# Altium project PCB_Project.PrjPcb (part 5 of 10)

## Sheet УШЯИ.411618.029Э Э3 Лист 4.schdoc
size 420 x 297 mm; SheetNumber: 4; SheetTotal: 8
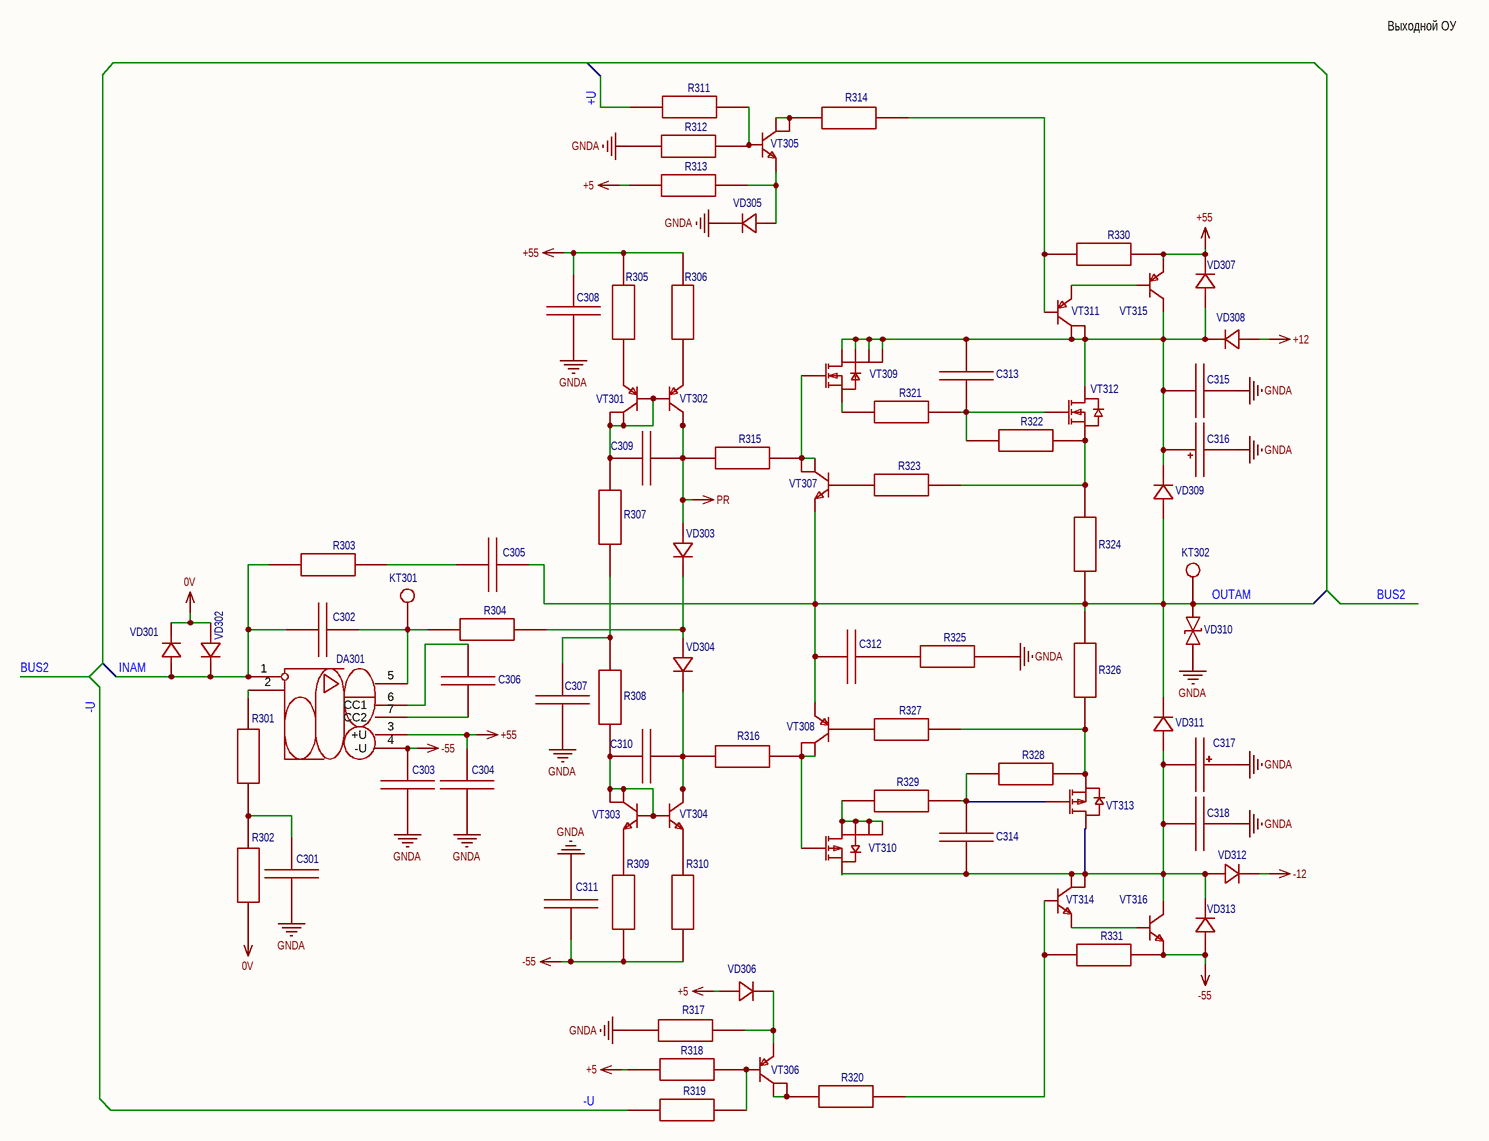
[diagram p3: УШЯИ.411618.029Э Э3 Лист 4.schdoc]

### Parts
C301  Конденсатор SMD 1мкФ 100В X7R 10% [0805]  [C0805]  (value not drawn)
C302  Конденсатор SMD 33пФ 100В X7R 10% [0805]  [C0805]  (value not drawn)
C303  Конденсатор SMD 68нФ 100В X7R 10% [0805]  [C0805]  (value not drawn)
C304  Конденсатор SMD 68нФ 100В X7R 10% [0805]  [C0805]  (value not drawn)
C305  Конденсатор SMD 10пФ 100В X7R 10% [0805]  [C0805]  (value not drawn)
C306  Конденсатор SMD 10пФ 100В X7R 10% [0805]  [C0805]  (value not drawn)
C307  Конденсатор SMD 68нФ 250В X7R 10% [0805]  [C0805]  (value not drawn)
C308  Конденсатор SMD 68нФ 250В X7R 10% [0805]  [C0805]  (value not drawn)
C309  Конденсатор SMD 10пФ 100В X7R 10% [0805]  [C0805]  (value not drawn)
C310  Конденсатор SMD 10пФ 100В X7R 10% [0805]  [C0805]  (value not drawn)
C311  Конденсатор SMD 68нФ 250В X7R 10% [0805]  [C0805]  (value not drawn)
C312  Конденсатор SMD 10пФ 100В X7R 10% [0805]  [C0805]  (value not drawn)
C313  Конденсатор SMD 10пФ 100В X7R 10% [0805]  [C0805]  (value not drawn)
C314  Конденсатор SMD 10пФ 100В X7R 10% [0805]  [C0805]  (value not drawn)
C315  Конденсатор SMD 10пФ 100В X7R 10% [0805]  [C0805]  (value not drawn)
C316  ECAP (К50-35), 220мкФ, 100В, 105°C, 13x25, p:5мм  [CAP-TH_BD13.0-P5.00-D0.6-FD]  (value not drawn)
C317  ECAP (К50-35), 220мкФ, 100В, 105°C, 13x25, p:5мм  [CAP-TH_BD13.0-P5.00-D0.6-FD]  (value not drawn)
C318  Конденсатор SMD 10пФ 100В X7R 10% [0805]  [C0805]  (value not drawn)
DA301  Операционный усилитель PA340CC [TH]  (value not drawn)
KT301  Control point  (value not drawn)
KT302  Control point  (value not drawn)
R301  Резистор 4.6кОм 0,125Вт 1% [0805]  [R0805]  (value not drawn)
R302  Резистор 1.2кОм 0,125Вт 1% [0805]  [R0805]  (value not drawn)
R303  Резистор 1.8кОм 0,125Вт 1% [0805]  [R0805]  (value not drawn)
R304  Резистор 1.2кОм 0,125Вт 1% [0805]  [R0805]  (value not drawn)
R305  Резистор 220Ом 0,125Вт 1% [0805]  [R0805]  (value not drawn)
R306  Резистор 220Ом 0,125Вт 1% [0805]  [R0805]  (value not drawn)
R307  Резистор 22кОм 0,125Вт 1% [0805]  [R0805]  (value not drawn)
R308  Резистор 22кОм 0,125Вт 1% [0805]  [R0805]  (value not drawn)
R309  Резистор 220Ом 0,125Вт 1% [0805]  [R0805]  (value not drawn)
R310  Резистор 220Ом 0,125Вт 1% [0805]  [R0805]  (value not drawn)
R311  Резистор 3кОм 0,125Вт 1% [0805]  [R0805]  (value not drawn)
R312  Резистор 2.4кОм 0,125Вт 1% [0805]  [R0805]  (value not drawn)
R313  Резистор 7.2кОм 0,125Вт 1% [0805]  [R0805]  (value not drawn)
R314  Резистор 18кОм 0,125Вт 1% [0805]  [R0805]  (value not drawn)
R315  Резистор 120Ом 0,125Вт 1% [0805]  [R0805]  (value not drawn)
R316  Резистор 120Ом 0,125Вт 1% [0805]  [R0805]  (value not drawn)
R317  Резистор 7.2кОм 0,125Вт 1% [0805]  [R0805]  (value not drawn)
R318  Резистор 2.4кОм 0,125Вт 1% [0805]  [R0805]  (value not drawn)
R319  Резистор 3кОм 0,125Вт 1% [0805]  [R0805]  (value not drawn)
R320  Резистор 18кОм 0,125Вт 1% [0805]  [R0805]  (value not drawn)
R321  Резистор 240Ом 0.25Вт 1% [1206]  [R0805]  (value not drawn)
R322  Резистор 1кОм 0,125Вт 5% [0805]  [R0805]  (value not drawn)
R323  Резистор 300Ом 0,125Вт 1% [0805]  [R0805]  (value not drawn)
R324  Резистор MP930-0.04-1% [TO-220-2]  [TO-220-2_L10.4-W3.2-P5.08-L]  (value not drawn)
R325  Резистор 100Ом 0,125Вт 1% [0805]  [R0805]  (value not drawn)
R326  Резистор MP930-0.04-1% [TO-220-2]  [TO-220-2_L10.4-W3.2-P5.08-L]  (value not drawn)
R327  Резистор 300Ом 0,125Вт 1% [0805]  [R0805]  (value not drawn)
R328  Резистор 1кОм 0,125Вт 5% [0805]  [R0805]  (value not drawn)
R329  Резистор 240Ом 0.25Вт 1% [1206]  [R0805]  (value not drawn)
R330  Резистор 1.5кОм 0,125Вт 1% [0805]  [R0805]  (value not drawn)
R331  Резистор 1.5кОм 0,125Вт 1% [0805]  [R0805]  (value not drawn)
VD301  Диод импульсный 1N4448 [SOD-123]  [SOD-123_L2.7-W1.6-LS3.7-RD-1]  (value not drawn)
VD302  Диод импульсный 1N4448 [SOD-123]  [SOD-123_L2.7-W1.6-LS3.7-RD-1]  (value not drawn)
VD303  Диод импульсный 1N4448 [SOD-123]  [SOD-123_L2.7-W1.6-LS3.7-RD-1]  (value not drawn)
VD304  Диод импульсный 1N4448 [SOD-123]  [SOD-123_L2.7-W1.6-LS3.7-RD-1]  (value not drawn)
VD305  Диод импульсный 1N4448 [SOD-123]  [SOD-123_L2.7-W1.6-LS3.7-RD-1]  (value not drawn)
VD306  Диод импульсный 1N4448 [SOD-123]  [SOD-123_L2.7-W1.6-LS3.7-RD-1]  (value not drawn)
VD307  Диод RS1M [SMA] (допускается замена на FR307 [DO-201AD])  (value not drawn)
VD308  Диод КД2970А [TO-220AC]  [TO-220AC-2_L10.0-W4.5-P5.08-T]  (value not drawn)
VD309  Диод RS1M [SMA] (допускается замена на FR307 [DO-201AD])  (value not drawn)
VD310  Диод защитный 1.5KE56CA [DO-201AD/DO-27]  [DO-201]  (value not drawn)
VD311  Диод RS1M [SMA] (допускается замена на FR307 [DO-201AD])  (value not drawn)
VD312  Диод КД2970А [TO-220AC]  [TO-220AC-2_L10.0-W4.5-P5.08-T]  (value not drawn)
VD313  Диод RS1M [SMA] (допускается замена на FR307 [DO-201AD])  (value not drawn)
VT301  Транзистор DZTA92 PNP [SOT223]  [SOT-223-3_L6.5-W3.4-P2.30-LS7.0-BR]  (value not drawn)
VT302  Транзистор FZT758 PNP [SOT223]  [SOT-223_L6.5-W3.5-P2.30-LS7.0-BR]  (value not drawn)
VT303  Транзистор DZTA42 NPN [SOT223]  [SOT-223-4_L6.5-W3.5-P2.30-LS7.0-BR]  (value not drawn)
VT304  Транзистор FZT658 NPN [SOT223]  [SOT-223_L6.5-W3.5-P2.30-LS7.0-BR]  (value not drawn)
VT305  Транзистор DZTA42 NPN [SOT223]  [SOT-223-4_L6.5-W3.5-P2.30-LS7.0-BR]  (value not drawn)
VT306  Транзистор DZTA92 PNP [SOT223]  [SOT-223-3_L6.5-W3.4-P2.30-LS7.0-BR]  (value not drawn)
VT307  Транзистор DZTA42 NPN [SOT223]  [SOT-223-4_L6.5-W3.5-P2.30-LS7.0-BR]  (value not drawn)
VT308  Транзистор DZTA92 PNP [SOT223]  [SOT-223-3_L6.5-W3.4-P2.30-LS7.0-BR]  (value not drawn)
VT309  Транзистор ZXMN10A08E6 N-канал 100В 1.9А [SOT-23-6]  [SOT-23-6_L2.9-W1.6-P0.95-LS2.7-BL]  (value not drawn)
VT310  Транзистор ZXMP10A17E6 P-канал 100В 1.3А [SOT-23-6]  [SOT-23-6_L2.9-W1.6-P0.95-LS2.8-BL]  (value not drawn)
VT311  Транзистор DZTA92 PNP [SOT223]  [SOT-223-3_L6.5-W3.4-P2.30-LS7.0-BR]  (value not drawn)
VT312  Транзистор FQP13N10  N-канал 100В 12.8А [TO-220]  (value not drawn)
VT313  Транзистор SFP9530 P-канал 100В 10.5А [TO-220]  (value not drawn)
VT314  Транзистор DZTA42 NPN [SOT223]  [SOT-223-4_L6.5-W3.5-P2.30-LS7.0-BR]  (value not drawn)
VT315  Транзистор MJE5730G PNP [TO-220-3]  [TO-220-3_L10.0-W4.5-P2.54-L]  (value not drawn)
VT316  Транзистор TIP48 NPN [TO-220-3]  [TO-220-3_L10.0-W4.5-P2.54-L]  (value not drawn)

### Nets
0V: R302.1 VD301.1(C) VD302.2(A)
+5: R313.1 R318.1 VD306.2(A)
+12: VD308.3(A)
+55: C304.2 C308.1 DA301.3(+U) R305.1 R306.1 R330.2 VD307.1(K) VT315.3(E)
-12: VD312.1(K)
-55: C303.2 C311.2 DA301.4(-U) R309.1 R310.1 R331.2 VD313.2(A) VT316.3(E)
GNDA: C301.1 C303.1 C304.1 C307.1 C308.2 C311.1 C315.2 C316.2 C317.1 C318.2 R312.1 R317.1 R325.2 VD305.1(C) VD310.1
PR: C309.1 R315.1 VD303.2(A) VT302.2(C) VT302.4(C)
+U: R311.1
-U: R319.1
INAM: C302.2 DA301.1(-) R303.2 VD301.2(A) VD302.1(C)
OUTAM: C305.1 C312.1 KT302.1 R324.1 R326.2 VD309.2(A) VD310.2 VD311.1(K) VT307.3(E) VT308.3(E)
NetC301_2: C301.2 R301.1 R302.2
NetC302_1: C302.1 DA301.5(Out) KT301.1 R304.2
NetC305_2: C305.2 R303.1
NetC306_1: C306.1 DA301.6(CC1)
NetC306_2: C306.2 DA301.7(CC2)
NetC307_2: C307.2 R307.2 R308.2
NetC309_2: C309.2 R307.1 VT301.1(B) VT301.2(C) VT301.4(C) VT302.1(B)
NetC310_1: C310.1 R316.1 VD304.1(C) VT304.2(C) VT304.4(C)
NetC310_2: C310.2 R308.1 VT303.1(B) VT303.2(C) VT303.4(C) VT304.1(B)
NetC312_2: C312.2 R325.1
NetC313_1: C313.1 C315.1 C316.1 VD307.2(A) VD308.1(K) VD309.1(K) VT309.1(D) VT309.2(D) VT309.5(D) VT309.6(D) VT311.2(C) VT311.4(C) VT312.2(D) VT315.2(C)
NetC313_2: C313.2 R321.2 R322.2 VT312.1(G)
NetC314_1: C314.1 R328.1 R329.2 VT313.1(G)
NetC314_2: C314.2 C317.2 C318.1 VD311.2(A) VD312.3(A) VD313.1(K) VT310.4(S) VT313.2(D) VT314.2(C) VT314.4(C) VT316.2(C)
NetDA301_2: DA301.2(+) R301.2
NetR304_1: R304.1 VD303.1(C) VD304.2(A)
NetR305_2: R305.2 VT301.3(E)
NetR306_2: R306.2 VT302.3(E)
NetR309_2: R309.2 VT303.3(E)
NetR310_2: R310.2 VT304.3(E)
NetR311_2: R311.2 R312.2 VT305.1(B)
NetR313_2: R313.2 VD305.2(A) VT305.3(E)
NetR314_1: R314.1 VT305.2(C) VT305.4(C)
NetR314_2: R314.2 R330.1 VT311.1(B)
NetR315_2: R315.2 VT307.2(C) VT307.4(C) VT309.3(G)
NetR316_2: R316.2 VT308.2(C) VT308.4(C) VT310.3(G)
NetR317_2: R317.2 VD306.1(C) VT306.3(E)
NetR318_2: R318.2 R319.2 VT306.1(B)
NetR320_1: R320.1 VT306.2(C) VT306.4(C)
NetR320_2: R320.2 R331.1 VT314.1(B)
NetR321_1: R321.1 VT309.4(S)
NetR322_1: R322.1 R323.2 R324.2 VT312.3(S)
NetR323_1: R323.1 VT307.1(B)
NetR326_1: R326.1 R327.2 R328.2 VT313.3(S)
NetR327_1: R327.1 VT308.1(B)
NetR329_1: R329.1 VT310.1(D) VT310.2(D) VT310.5(D) VT310.6(D)
NetVT311_3: VT311.3(E) VT315.1(B)
NetVT314_3: VT314.3(E) VT316.1(B)

### Buses and harness runs
bus BUS2

### Notes on the sheet
- Выходной ОУ
- Подп. и дата
- Инв.№ дубл.
- Взам.инв.№
- Подп.и дата
- Инв.№ подл.
- Изм.
- Лист
- № докум.
- Подп.
- Дата
- Формат  A3

### Library data of the parts
C301 = Конденсатор SMD 1мкФ 100В X7R 10% [0805]: Contributor: jordanjin; Convert to PCB: yes; UniqueId: gge0f82af17b1059d9e; Origin Footprint: C0805; Device: Конденсатор SMD 1мкФ 100В X7R 10% [0805]; Symbol: Конденсатор SMD 1мкФ 100В X7R 10% [0805]; Manufacturer Part: C0805; spicePre: C; spiceSymbolName: Конденсатор SMD 100нФ 100В X7R 10% [0805]; Add into BOM: yes; FootprintName: C0805
C302 = Конденсатор SMD 33пФ 100В X7R 10% [0805]: Contributor: jordanjin; Convert to PCB: yes; UniqueId: gge26cd05763e454dc0; Origin Footprint: C0805; Device: Конденсатор SMD 33пФ 100В X7R 10% [0805]; Symbol: Конденсатор SMD 33пФ 100В X7R 10% [0805]; Manufacturer Part: C0805; spicePre: C; spiceSymbolName: Конденсатор SMD 100нФ 100В X7R 10% [0805]; Add into BOM: yes; FootprintName: C0805
C303 = Конденсатор SMD 68нФ 100В X7R 10% [0805]: Contributor: jordanjin; Convert to PCB: yes; UniqueId: ggedf5c42e49c7cc26e; Origin Footprint: C0805; Device: Конденсатор SMD 68нФ 100В X7R 10% [0805]; Symbol: Конденсатор SMD 68нФ 100В X7R 10% [0805]; Manufacturer Part: C0805; spicePre: C; spiceSymbolName: Конденсатор SMD 100нФ 100В X7R 10% [0805]; Add into BOM: yes; FootprintName: C0805
C304 = Конденсатор SMD 68нФ 100В X7R 10% [0805]: Contributor: jordanjin; Convert to PCB: yes; UniqueId: gged5cf4cf4a29966fc; Origin Footprint: C0805; Device: Конденсатор SMD 68нФ 100В X7R 10% [0805]; Symbol: Конденсатор SMD 68нФ 100В X7R 10% [0805]; Manufacturer Part: C0805; spicePre: C; spiceSymbolName: Конденсатор SMD 100нФ 100В X7R 10% [0805]; Add into BOM: yes; FootprintName: C0805
C305 = Конденсатор SMD 10пФ 100В X7R 10% [0805]: Contributor: jordanjin; Convert to PCB: yes; UniqueId: ggedef2608488099cc0; Origin Footprint: C0805; Device: Конденсатор SMD 10пФ 100В X7R 10% [0805]; Symbol: Конденсатор SMD 10пФ 100В X7R 10% [0805]; Manufacturer Part: C0805; spicePre: C; spiceSymbolName: Конденсатор SMD 100нФ 100В X7R 10% [0805]; Add into BOM: yes; FootprintName: C0805
C306 = Конденсатор SMD 10пФ 100В X7R 10% [0805]: Contributor: jordanjin; Convert to PCB: yes; UniqueId: ggef91583ce116bdb52; Origin Footprint: C0805; Device: Конденсатор SMD 10пФ 100В X7R 10% [0805]; Symbol: Конденсатор SMD 10пФ 100В X7R 10% [0805]; Manufacturer Part: C0805; spicePre: C; spiceSymbolName: Конденсатор SMD 100нФ 100В X7R 10% [0805]; Add into BOM: yes; FootprintName: C0805
C307 = Конденсатор SMD 68нФ 250В X7R 10% [0805]: Contributor: jordanjin; Convert to PCB: yes; UniqueId: gge15aca19a3a582702; Origin Footprint: C0805; Device: Конденсатор SMD 68нФ 250В X7R 10% [0805]; Symbol: Конденсатор SMD 68нФ 250В X7R 10% [0805]; Manufacturer Part: C0805; spicePre: C; spiceSymbolName: Конденсатор SMD 100нФ 100В X7R 10% [0805]; Add into BOM: yes; FootprintName: C0805
C308 = Конденсатор SMD 68нФ 250В X7R 10% [0805]: Contributor: jordanjin; Convert to PCB: yes; UniqueId: gge93f8d871f7b0b0ae; Origin Footprint: C0805; Device: Конденсатор SMD 68нФ 250В X7R 10% [0805]; Symbol: Конденсатор SMD 68нФ 250В X7R 10% [0805]; Manufacturer Part: C0805; spicePre: C; spiceSymbolName: Конденсатор SMD 100нФ 100В X7R 10% [0805]; Add into BOM: yes; FootprintName: C0805
C309 = Конденсатор SMD 10пФ 100В X7R 10% [0805]: Contributor: jordanjin; Convert to PCB: yes; UniqueId: ggea76501cfc0b23d2d; Origin Footprint: C0805; Device: Конденсатор SMD 10пФ 100В X7R 10% [0805]; Symbol: Конденсатор SMD 10пФ 100В X7R 10% [0805]; Manufacturer Part: C0805; spicePre: C; spiceSymbolName: Конденсатор SMD 100нФ 100В X7R 10% [0805]; Add into BOM: yes; FootprintName: C0805
C310 = Конденсатор SMD 10пФ 100В X7R 10% [0805]: Contributor: jordanjin; Convert to PCB: yes; UniqueId: ggeadc4d9bfe63e7c4e; Origin Footprint: C0805; Device: Конденсатор SMD 10пФ 100В X7R 10% [0805]; Symbol: Конденсатор SMD 10пФ 100В X7R 10% [0805]; Manufacturer Part: C0805; spicePre: C; spiceSymbolName: Конденсатор SMD 100нФ 100В X7R 10% [0805]; Add into BOM: yes; FootprintName: C0805
C311 = Конденсатор SMD 68нФ 250В X7R 10% [0805]: Contributor: jordanjin; Convert to PCB: yes; UniqueId: ggefa3ff9baf1758d60; Origin Footprint: C0805; Device: Конденсатор SMD 68нФ 250В X7R 10% [0805]; Symbol: Конденсатор SMD 68нФ 250В X7R 10% [0805]; Manufacturer Part: C0805; spicePre: C; spiceSymbolName: Конденсатор SMD 100нФ 100В X7R 10% [0805]; Add into BOM: yes; FootprintName: C0805
C312 = Конденсатор SMD 10пФ 100В X7R 10% [0805]: Contributor: jordanjin; Convert to PCB: yes; UniqueId: ggea607186c08aa057a; Origin Footprint: C0805; Device: Конденсатор SMD 10пФ 100В X7R 10% [0805]; Symbol: Конденсатор SMD 10пФ 100В X7R 10% [0805]; Manufacturer Part: C0805; spicePre: C; spiceSymbolName: Конденсатор SMD 100нФ 100В X7R 10% [0805]; Add into BOM: yes; FootprintName: C0805
C313 = Конденсатор SMD 10пФ 100В X7R 10% [0805]: Contributor: jordanjin; Convert to PCB: yes; UniqueId: gge9e7b3f4a13bee05d; Origin Footprint: C0805; Device: Конденсатор SMD 10пФ 100В X7R 10% [0805]; Symbol: Конденсатор SMD 10пФ 100В X7R 10% [0805]; Manufacturer Part: C0805; spicePre: C; spiceSymbolName: Конденсатор SMD 100нФ 100В X7R 10% [0805]; Add into BOM: yes; FootprintName: C0805
C314 = Конденсатор SMD 10пФ 100В X7R 10% [0805]: Contributor: jordanjin; Convert to PCB: yes; UniqueId: ggec9cb2e765516c74f; Origin Footprint: C0805; Device: Конденсатор SMD 10пФ 100В X7R 10% [0805]; Symbol: Конденсатор SMD 10пФ 100В X7R 10% [0805]; Manufacturer Part: C0805; spicePre: C; spiceSymbolName: Конденсатор SMD 100нФ 100В X7R 10% [0805]; Add into BOM: yes; FootprintName: C0805
C315 = Конденсатор SMD 10пФ 100В X7R 10% [0805]: Contributor: jordanjin; Convert to PCB: yes; UniqueId: gge48851c0533e8d891; Origin Footprint: C0805; Device: Конденсатор SMD 10пФ 100В X7R 10% [0805]; Symbol: Конденсатор SMD 10пФ 100В X7R 10% [0805]; Manufacturer Part: C0805; spicePre: C; spiceSymbolName: Конденсатор SMD 100нФ 100В X7R 10% [0805]; Add into BOM: yes; FootprintName: C0805
C316 = ECAP (К50-35), 220мкФ, 100В, 105°C, 13x25, p:5мм: Manufacturer: JB Capacitors; Manufacturer Part: JRB2A221M05001300250000B; nameAlias: Value; Contributor: jordanjin; Convert to PCB: yes; UniqueId: ggefdf80f351a6aebb5; Origin Footprint: CAP-TH_BD13.0-P5.00-D0.6-FD; Device: ECAP (К50-35), 220мкФ, 100В, 105°C, 13x25, p:5мм; Symbol: ECAP (К50-35), 220мкФ, 100В, 105°C, 13x25, p:5мм; Supplier: LCSC; JLCPCB Part Class: Extended Part; spicePre: C; spiceSymbolName: ECAP (К50-35), 47мкФ, 250В, 105°C, 13x25, p:5мм; Add into BOM: yes; FootprintName: CAP-TH_BD13.0-P5.00-D0.6-FD
C317 = ECAP (К50-35), 220мкФ, 100В, 105°C, 13x25, p:5мм: Manufacturer: JB Capacitors; Manufacturer Part: JRB2A221M05001300250000B; nameAlias: Value; Contributor: jordanjin; Convert to PCB: yes; UniqueId: gge4700efebc63aa1ed; Origin Footprint: CAP-TH_BD13.0-P5.00-D0.6-FD; Device: ECAP (К50-35), 220мкФ, 100В, 105°C, 13x25, p:5мм; Symbol: ECAP (К50-35), 220мкФ, 100В, 105°C, 13x25, p:5мм; Supplier: LCSC; JLCPCB Part Class: Extended Part; spicePre: C; spiceSymbolName: ECAP (К50-35), 47мкФ, 250В, 105°C, 13x25, p:5мм; Add into BOM: yes; FootprintName: CAP-TH_BD13.0-P5.00-D0.6-FD
C318 = Конденсатор SMD 10пФ 100В X7R 10% [0805]: Contributor: jordanjin; Convert to PCB: yes; UniqueId: gge001219996573d934; Origin Footprint: C0805; Device: Конденсатор SMD 10пФ 100В X7R 10% [0805]; Symbol: Конденсатор SMD 10пФ 100В X7R 10% [0805]; Manufacturer Part: C0805; spicePre: C; spiceSymbolName: Конденсатор SMD 100нФ 100В X7R 10% [0805]; Add into BOM: yes; FootprintName: C0805
DA301 = Операционный усилитель PA340CC [TH]: Manufacturer: Apex Microtechnology; Contributor: jordanjin; Convert to PCB: yes; UniqueId: gge81f65e8ba2ed8df7; Origin Footprint: PA340CC; Device: Операционный усилитель PA340CC [TH]; Symbol: Операционный усилитель PA340CC [TH]; Manufacturer Part: PA340CC; link: https://www.apexanalog.com/products/pa340.html; spicePre: D; spiceSymbolName: Операционный усилитель PA340CC [TH]; Add into BOM: yes
KT301 = Control point: Contributor: jordanjin; Convert to PCB: yes; UniqueId: gge7dd4b290aa3080d1; Origin Footprint: CONTROL POINT; Device: Control point; Symbol: Control point; Manufacturer Part: Control point; spicePre: K; spiceSymbolName: Control point; Add into BOM: yes
KT302 = Control point: Contributor: jordanjin; Convert to PCB: yes; UniqueId: ggefca8c0d1c63d776a; Origin Footprint: CONTROL POINT; Device: Control point; Symbol: Control point; Manufacturer Part: Control point; spicePre: K; spiceSymbolName: Control point; Add into BOM: yes
R301 = Резистор 4.6кОм 0,125Вт 1% [0805]: Contributor: jordanjin; Convert to PCB: yes; UniqueId: gge7683eff9dec59f1f; ModelId: de27d504f5024d53a3020ec2611f5e5e; Origin Footprint: R0805; Device: Резистор 4.6кОм 0,125Вт 1% [0805]; Symbol: Резистор 4.6кОм 0,125Вт 1% [0805]; Manufacturer Part: R0805; spicePre: R; spiceSymbolName: Резистор 12кОм 0,125Вт 1% [0805]; Add into BOM: yes; FootprintName: R0805; ModelName: R0805
R302 = Резистор 1.2кОм 0,125Вт 1% [0805]: Contributor: jordanjin; Convert to PCB: yes; UniqueId: gge03de877ff3dfc2cf; ModelId: de27d504f5024d53a3020ec2611f5e5e; Origin Footprint: R0805; Device: Резистор 1.2кОм 0,125Вт 1% [0805]; Symbol: Резистор 1.2кОм 0,125Вт 1% [0805]; Manufacturer Part: R0805; spicePre: R; spiceSymbolName: Резистор 12кОм 0,125Вт 1% [0805]; Add into BOM: yes; FootprintName: R0805; ModelName: R0805
R303 = Резистор 1.8кОм 0,125Вт 1% [0805]: Contributor: jordanjin; Convert to PCB: yes; UniqueId: gge291deede55bf421f; ModelId: de27d504f5024d53a3020ec2611f5e5e; Origin Footprint: R0805; Device: Резистор 1.8кОм 0,125Вт 1% [0805]; Symbol: Резистор 1.8кОм 0,125Вт 1% [0805]; Manufacturer Part: R0805; spicePre: R; spiceSymbolName: Резистор 12кОм 0,125Вт 1% [0805]; Add into BOM: yes; FootprintName: R0805; ModelName: R0805
R304 = Резистор 1.2кОм 0,125Вт 1% [0805]: Contributor: jordanjin; Convert to PCB: yes; UniqueId: gge474cff6ad2df3446; ModelId: de27d504f5024d53a3020ec2611f5e5e; Origin Footprint: R0805; Device: Резистор 1.2кОм 0,125Вт 1% [0805]; Symbol: Резистор 1.2кОм 0,125Вт 1% [0805]; Manufacturer Part: R0805; spicePre: R; spiceSymbolName: Резистор 12кОм 0,125Вт 1% [0805]; Add into BOM: yes; FootprintName: R0805; ModelName: R0805
R305 = Резистор 220Ом 0,125Вт 1% [0805]: Contributor: jordanjin; Convert to PCB: yes; UniqueId: gge4d08d2e8803d5993; ModelId: de27d504f5024d53a3020ec2611f5e5e; Origin Footprint: R0805; Device: Резистор 220Ом 0,125Вт 1% [0805]; Symbol: Резистор 220Ом 0,125Вт 1% [0805]; Manufacturer Part: R0805; spicePre: R; spiceSymbolName: Резистор 12кОм 0,125Вт 1% [0805]; Add into BOM: yes; FootprintName: R0805; ModelName: R0805
R306 = Резистор 220Ом 0,125Вт 1% [0805]: Contributor: jordanjin; Convert to PCB: yes; UniqueId: gge2f84cea7a5b82b6f; ModelId: de27d504f5024d53a3020ec2611f5e5e; Origin Footprint: R0805; Device: Резистор 220Ом 0,125Вт 1% [0805]; Symbol: Резистор 220Ом 0,125Вт 1% [0805]; Manufacturer Part: R0805; spicePre: R; spiceSymbolName: Резистор 12кОм 0,125Вт 1% [0805]; Add into BOM: yes; FootprintName: R0805; ModelName: R0805
R307 = Резистор 22кОм 0,125Вт 1% [0805]: Contributor: jordanjin; Convert to PCB: yes; UniqueId: ggeee7bf9b9f12e7431; ModelId: de27d504f5024d53a3020ec2611f5e5e; Origin Footprint: R0805; Device: Резистор 22кОм 0,125Вт 1% [0805]; Symbol: Резистор 22кОм 0,125Вт 1% [0805]; Manufacturer Part: R0805; spicePre: R; spiceSymbolName: Резистор 12кОм 0,125Вт 1% [0805]; Add into BOM: yes; FootprintName: R0805; ModelName: R0805
R308 = Резистор 22кОм 0,125Вт 1% [0805]: Contributor: jordanjin; Convert to PCB: yes; UniqueId: gge8df833172a9ad4d5; ModelId: de27d504f5024d53a3020ec2611f5e5e; Origin Footprint: R0805; Device: Резистор 22кОм 0,125Вт 1% [0805]; Symbol: Резистор 22кОм 0,125Вт 1% [0805]; Manufacturer Part: R0805; spicePre: R; spiceSymbolName: Резистор 12кОм 0,125Вт 1% [0805]; Add into BOM: yes; FootprintName: R0805; ModelName: R0805
R309 = Резистор 220Ом 0,125Вт 1% [0805]: Contributor: jordanjin; Convert to PCB: yes; UniqueId: ggeccc2f1afa07feb02; ModelId: de27d504f5024d53a3020ec2611f5e5e; Origin Footprint: R0805; Device: Резистор 220Ом 0,125Вт 1% [0805]; Symbol: Резистор 220Ом 0,125Вт 1% [0805]; Manufacturer Part: R0805; spicePre: R; spiceSymbolName: Резистор 12кОм 0,125Вт 1% [0805]; Add into BOM: yes; FootprintName: R0805; ModelName: R0805
R310 = Резистор 220Ом 0,125Вт 1% [0805]: Contributor: jordanjin; Convert to PCB: yes; UniqueId: gge6ec9268e7e5d9fea; ModelId: de27d504f5024d53a3020ec2611f5e5e; Origin Footprint: R0805; Device: Резистор 220Ом 0,125Вт 1% [0805]; Symbol: Резистор 220Ом 0,125Вт 1% [0805]; Manufacturer Part: R0805; spicePre: R; spiceSymbolName: Резистор 12кОм 0,125Вт 1% [0805]; Add into BOM: yes; FootprintName: R0805; ModelName: R0805
R311 = Резистор 3кОм 0,125Вт 1% [0805]: Contributor: jordanjin; Convert to PCB: yes; UniqueId: ggecdfd9e02ba7bc7b4; ModelId: de27d504f5024d53a3020ec2611f5e5e; Origin Footprint: R0805; Device: Резистор 3кОм 0,125Вт 1% [0805]; Symbol: Резистор 3кОм 0,125Вт 1% [0805]; Manufacturer Part: R0805; spicePre: R; spiceSymbolName: Резистор 12кОм 0,125Вт 1% [0805]; Add into BOM: yes; FootprintName: R0805; ModelName: R0805
R312 = Резистор 2.4кОм 0,125Вт 1% [0805]: Contributor: jordanjin; Convert to PCB: yes; UniqueId: ggee22c828e250300a6; ModelId: de27d504f5024d53a3020ec2611f5e5e; Origin Footprint: R0805; Device: Резистор 2.4кОм 0,125Вт 1% [0805]; Symbol: Резистор 2.4кОм 0,125Вт 1% [0805]; Manufacturer Part: R0805; spicePre: R; spiceSymbolName: Резистор 12кОм 0,125Вт 1% [0805]; Add into BOM: yes; FootprintName: R0805; ModelName: R0805
R313 = Резистор 7.2кОм 0,125Вт 1% [0805]: Contributor: jordanjin; Convert to PCB: yes; UniqueId: gge28b4fbf0dd659939; ModelId: de27d504f5024d53a3020ec2611f5e5e; Origin Footprint: R0805; Device: Резистор 7.2кОм 0,125Вт 1% [0805]; Symbol: Резистор 7.2кОм 0,125Вт 1% [0805]; Manufacturer Part: R0805; spicePre: R; spiceSymbolName: Резистор 12кОм 0,125Вт 1% [0805]; Add into BOM: yes; FootprintName: R0805; ModelName: R0805
R314 = Резистор 18кОм 0,125Вт 1% [0805]: Contributor: jordanjin; Convert to PCB: yes; UniqueId: gge5546a21a884c6307; ModelId: de27d504f5024d53a3020ec2611f5e5e; Origin Footprint: R0805; Device: Резистор 18кОм 0,125Вт 1% [0805]; Symbol: Резистор 18кОм 0,125Вт 1% [0805]; Manufacturer Part: R0805; spicePre: R; spiceSymbolName: Резистор 12кОм 0,125Вт 1% [0805]; Add into BOM: yes; FootprintName: R0805; ModelName: R0805
R315 = Резистор 120Ом 0,125Вт 1% [0805]: Contributor: jordanjin; Convert to PCB: yes; UniqueId: gge0c0e2c19a10e255a; ModelId: de27d504f5024d53a3020ec2611f5e5e; Origin Footprint: R0805; Device: Резистор 120Ом 0,125Вт 1% [0805]; Symbol: Резистор 120Ом 0,125Вт 1% [0805]; Manufacturer Part: R0805; spicePre: R; spiceSymbolName: Резистор 12кОм 0,125Вт 1% [0805]; Add into BOM: yes; FootprintName: R0805; ModelName: R0805
R316 = Резистор 120Ом 0,125Вт 1% [0805]: Contributor: jordanjin; Convert to PCB: yes; UniqueId: gge70879b78d11ab054; ModelId: de27d504f5024d53a3020ec2611f5e5e; Origin Footprint: R0805; Device: Резистор 120Ом 0,125Вт 1% [0805]; Symbol: Резистор 120Ом 0,125Вт 1% [0805]; Manufacturer Part: R0805; spicePre: R; spiceSymbolName: Резистор 12кОм 0,125Вт 1% [0805]; Add into BOM: yes; FootprintName: R0805; ModelName: R0805
R317 = Резистор 7.2кОм 0,125Вт 1% [0805]: Contributor: jordanjin; Convert to PCB: yes; UniqueId: gge859b26eaef412748; ModelId: de27d504f5024d53a3020ec2611f5e5e; Origin Footprint: R0805; Device: Резистор 7.2кОм 0,125Вт 1% [0805]; Symbol: Резистор 7.2кОм 0,125Вт 1% [0805]; Manufacturer Part: R0805; spicePre: R; spiceSymbolName: Резистор 12кОм 0,125Вт 1% [0805]; Add into BOM: yes; FootprintName: R0805; ModelName: R0805
R318 = Резистор 2.4кОм 0,125Вт 1% [0805]: Contributor: jordanjin; Convert to PCB: yes; UniqueId: gge5092b667f7a1fbe0; ModelId: de27d504f5024d53a3020ec2611f5e5e; Origin Footprint: R0805; Device: Резистор 2.4кОм 0,125Вт 1% [0805]; Symbol: Резистор 2.4кОм 0,125Вт 1% [0805]; Manufacturer Part: R0805; spicePre: R; spiceSymbolName: Резистор 12кОм 0,125Вт 1% [0805]; Add into BOM: yes; FootprintName: R0805; ModelName: R0805
R319 = Резистор 3кОм 0,125Вт 1% [0805]: Contributor: jordanjin; Convert to PCB: yes; UniqueId: ggef809131c8b71481b; ModelId: de27d504f5024d53a3020ec2611f5e5e; Origin Footprint: R0805; Device: Резистор 3кОм 0,125Вт 1% [0805]; Symbol: Резистор 3кОм 0,125Вт 1% [0805]; Manufacturer Part: R0805; spicePre: R; spiceSymbolName: Резистор 12кОм 0,125Вт 1% [0805]; Add into BOM: yes; FootprintName: R0805; ModelName: R0805
R320 = Резистор 18кОм 0,125Вт 1% [0805]: Contributor: jordanjin; Convert to PCB: yes; UniqueId: gge9bc7b1efc6d85928; ModelId: de27d504f5024d53a3020ec2611f5e5e; Origin Footprint: R0805; Device: Резистор 18кОм 0,125Вт 1% [0805]; Symbol: Резистор 18кОм 0,125Вт 1% [0805]; Manufacturer Part: R0805; spicePre: R; spiceSymbolName: Резистор 12кОм 0,125Вт 1% [0805]; Add into BOM: yes; FootprintName: R0805; ModelName: R0805
R321 = Резистор 240Ом 0.25Вт 1% [1206]: Contributor: jordanjin; Convert to PCB: yes; UniqueId: gge1020a512f52a3aa7; ModelId: de27d504f5024d53a3020ec2611f5e5e; Origin Footprint: R0805; Device: Резистор 240Ом 0.25Вт 1% [1206]; Symbol: Резистор 240Ом 0.25Вт 1% [1206]; Manufacturer Part: R0805; spicePre: R; spiceSymbolName: Резистор 12кОм 0,125Вт 1% [0805]; Add into BOM: yes; FootprintName: R0805; ModelName: R0805
R322 = Резистор 1кОм 0,125Вт 5% [0805]: Contributor: jordanjin; Convert to PCB: yes; UniqueId: gge32092000e46227de; ModelId: de27d504f5024d53a3020ec2611f5e5e; Origin Footprint: R0805; Device: Резистор 1кОм 0,125Вт 5% [0805]; Symbol: Резистор 1кОм 0,125Вт 5% [0805]; Manufacturer Part: R0805; spicePre: R; spiceSymbolName: Резистор 12кОм 0,125Вт 1% [0805]; Add into BOM: yes; FootprintName: R0805; ModelName: R0805
R323 = Резистор 300Ом 0,125Вт 1% [0805]: Contributor: jordanjin; Convert to PCB: yes; UniqueId: gge421b70417230339f; ModelId: de27d504f5024d53a3020ec2611f5e5e; Origin Footprint: R0805; Device: Резистор 300Ом 0,125Вт 1% [0805]; Symbol: Резистор 300Ом 0,125Вт 1% [0805]; Manufacturer Part: R0805; spicePre: R; spiceSymbolName: Резистор 12кОм 0,125Вт 1% [0805]; Add into BOM: yes; FootprintName: R0805; ModelName: R0805
R324 = Резистор MP930-0.04-1% [TO-220-2]: Contributor: jordanjin; Convert to PCB: yes; UniqueId: gge7a38aff62cf4ac36; ModelId: 670c0f0e5b9b4d3a964f1f27b9ac0995; Origin Footprint: TO-220-2_L10.4-W3.2-P5.08-L; Device: Резистор MP930-0.04-1% [TO-220-2]; Symbol: Резистор MP930-0.04-1% [TO-220-2]; Manufacturer Part: MP930-0.04-1%; spicePre: R; spiceSymbolName: Резистор 12кОм 0,125Вт 1% [0805]; Add into BOM: yes; FootprintName: TO-220-2_L10.4-W3.2-P5.08-L; ModelName: TO-220-2_L10.4-W3.2-P5.08-L
R325 = Резистор 100Ом 0,125Вт 1% [0805]: Contributor: jordanjin; Convert to PCB: yes; UniqueId: gge1474550085ef1e72; ModelId: de27d504f5024d53a3020ec2611f5e5e; Origin Footprint: R0805; Device: Резистор 100Ом 0,125Вт 1% [0805]; Symbol: Резистор 100Ом 0,125Вт 1% [0805]; Manufacturer Part: R0805; spicePre: R; spiceSymbolName: Резистор 12кОм 0,125Вт 1% [0805]; Add into BOM: yes; FootprintName: R0805; ModelName: R0805
R326 = Резистор MP930-0.04-1% [TO-220-2]: Contributor: jordanjin; Convert to PCB: yes; UniqueId: gge140a21944f615f91; ModelId: 670c0f0e5b9b4d3a964f1f27b9ac0995; Origin Footprint: TO-220-2_L10.4-W3.2-P5.08-L; Device: Резистор MP930-0.04-1% [TO-220-2]; Symbol: Резистор MP930-0.04-1% [TO-220-2]; Manufacturer Part: MP930-0.04-1%; spicePre: R; spiceSymbolName: Резистор 12кОм 0,125Вт 1% [0805]; Add into BOM: yes; FootprintName: TO-220-2_L10.4-W3.2-P5.08-L; ModelName: TO-220-2_L10.4-W3.2-P5.08-L
R327 = Резистор 300Ом 0,125Вт 1% [0805]: Contributor: jordanjin; Convert to PCB: yes; UniqueId: gge0c5b6a30375c873a; ModelId: de27d504f5024d53a3020ec2611f5e5e; Origin Footprint: R0805; Device: Резистор 300Ом 0,125Вт 1% [0805]; Symbol: Резистор 300Ом 0,125Вт 1% [0805]; Manufacturer Part: R0805; spicePre: R; spiceSymbolName: Резистор 12кОм 0,125Вт 1% [0805]; Add into BOM: yes; FootprintName: R0805; ModelName: R0805
R328 = Резистор 1кОм 0,125Вт 5% [0805]: Contributor: jordanjin; Convert to PCB: yes; UniqueId: ggef0355adb5b018c1c; ModelId: de27d504f5024d53a3020ec2611f5e5e; Origin Footprint: R0805; Device: Резистор 1кОм 0,125Вт 5% [0805]; Symbol: Резистор 1кОм 0,125Вт 5% [0805]; Manufacturer Part: R0805; spicePre: R; spiceSymbolName: Резистор 12кОм 0,125Вт 1% [0805]; Add into BOM: yes; FootprintName: R0805; ModelName: R0805
R329 = Резистор 240Ом 0.25Вт 1% [1206]: Contributor: jordanjin; Convert to PCB: yes; UniqueId: ggeecde81031abaa9ba; ModelId: de27d504f5024d53a3020ec2611f5e5e; Origin Footprint: R0805; Device: Резистор 240Ом 0.25Вт 1% [1206]; Symbol: Резистор 240Ом 0.25Вт 1% [1206]; Manufacturer Part: R0805; spicePre: R; spiceSymbolName: Резистор 12кОм 0,125Вт 1% [0805]; Add into BOM: yes; FootprintName: R0805; ModelName: R0805
R330 = Резистор 1.5кОм 0,125Вт 1% [0805]: Contributor: jordanjin; Convert to PCB: yes; UniqueId: gge3bd47006b7fd1579; ModelId: de27d504f5024d53a3020ec2611f5e5e; Origin Footprint: R0805; Device: Резистор 1.5кОм 0,125Вт 1% [0805]; Symbol: Резистор 1.5кОм 0,125Вт 1% [0805]; Manufacturer Part: R0805; spicePre: R; spiceSymbolName: Резистор 12кОм 0,125Вт 1% [0805]; Add into BOM: yes; FootprintName: R0805; ModelName: R0805
R331 = Резистор 1.5кОм 0,125Вт 1% [0805]: Contributor: jordanjin; Convert to PCB: yes; UniqueId: gge53a59f0116c0d1f6; ModelId: de27d504f5024d53a3020ec2611f5e5e; Origin Footprint: R0805; Device: Резистор 1.5кОм 0,125Вт 1% [0805]; Symbol: Резистор 1.5кОм 0,125Вт 1% [0805]; Manufacturer Part: R0805; spicePre: R; spiceSymbolName: Резистор 12кОм 0,125Вт 1% [0805]; Add into BOM: yes; FootprintName: R0805; ModelName: R0805
VD301 = Диод импульсный 1N4448 [SOD-123]: Manufacturer: YANGJIE; Manufacturer Part: 1N4448WQ; Contributor: jordanjin; Convert to PCB: yes; UniqueId: gge26c4b5a1da97e09a; ModelId: 5a61cd31046d4447ba73169a45a0935b; Origin Footprint: SOD-123_L2.7-W1.6-LS3.7-RD-1; Device: Диод импульсный 1N4448 [SOD-123]; Symbol: Диод импульсный 1N4448 [SOD-123]; Supplier: LCSC; JLCPCB Part Class: Extended Part; spicePre: V; spiceSymbolName: Диод импульсный 1N4448 [SOD-123]; Add into BOM: yes; FootprintName: SOD-123_L2.7-W1.6-LS3.7-RD-1; ModelName: SOD-123_L2.7-W1.6-LS3.7-RD-1
VD302 = Диод импульсный 1N4448 [SOD-123]: Manufacturer: YANGJIE; Manufacturer Part: 1N4448WQ; Contributor: jordanjin; Convert to PCB: yes; UniqueId: gge5cd0d772bae969d4; ModelId: 5a61cd31046d4447ba73169a45a0935b; Origin Footprint: SOD-123_L2.7-W1.6-LS3.7-RD-1; Device: Диод импульсный 1N4448 [SOD-123]; Symbol: Диод импульсный 1N4448 [SOD-123]; Supplier: LCSC; JLCPCB Part Class: Extended Part; spicePre: V; spiceSymbolName: Диод импульсный 1N4448 [SOD-123]; Add into BOM: yes; FootprintName: SOD-123_L2.7-W1.6-LS3.7-RD-1; ModelName: SOD-123_L2.7-W1.6-LS3.7-RD-1
VD303 = Диод импульсный 1N4448 [SOD-123]: Manufacturer: YANGJIE; Manufacturer Part: 1N4448WQ; Contributor: jordanjin; Convert to PCB: yes; UniqueId: gge4df46282ef1fa781; ModelId: 5a61cd31046d4447ba73169a45a0935b; Origin Footprint: SOD-123_L2.7-W1.6-LS3.7-RD-1; Device: Диод импульсный 1N4448 [SOD-123]; Symbol: Диод импульсный 1N4448 [SOD-123]; Supplier: LCSC; JLCPCB Part Class: Extended Part; spicePre: V; spiceSymbolName: Диод импульсный 1N4448 [SOD-123]; Add into BOM: yes; FootprintName: SOD-123_L2.7-W1.6-LS3.7-RD-1; ModelName: SOD-123_L2.7-W1.6-LS3.7-RD-1
VD304 = Диод импульсный 1N4448 [SOD-123]: Manufacturer: YANGJIE; Manufacturer Part: 1N4448WQ; Contributor: jordanjin; Convert to PCB: yes; UniqueId: gge6f92e5e145e0102e; ModelId: 5a61cd31046d4447ba73169a45a0935b; Origin Footprint: SOD-123_L2.7-W1.6-LS3.7-RD-1; Device: Диод импульсный 1N4448 [SOD-123]; Symbol: Диод импульсный 1N4448 [SOD-123]; Supplier: LCSC; JLCPCB Part Class: Extended Part; spicePre: V; spiceSymbolName: Диод импульсный 1N4448 [SOD-123]; Add into BOM: yes; FootprintName: SOD-123_L2.7-W1.6-LS3.7-RD-1; ModelName: SOD-123_L2.7-W1.6-LS3.7-RD-1
VD305 = Диод импульсный 1N4448 [SOD-123]: Manufacturer: YANGJIE; Manufacturer Part: 1N4448WQ; Contributor: jordanjin; Convert to PCB: yes; UniqueId: gge97cff0b923d9a97f; ModelId: 5a61cd31046d4447ba73169a45a0935b; Origin Footprint: SOD-123_L2.7-W1.6-LS3.7-RD-1; Device: Диод импульсный 1N4448 [SOD-123]; Symbol: Диод импульсный 1N4448 [SOD-123]; Supplier: LCSC; JLCPCB Part Class: Extended Part; spicePre: V; spiceSymbolName: Диод импульсный 1N4448 [SOD-123]; Add into BOM: yes; FootprintName: SOD-123_L2.7-W1.6-LS3.7-RD-1; ModelName: SOD-123_L2.7-W1.6-LS3.7-RD-1
VD306 = Диод импульсный 1N4448 [SOD-123]: Manufacturer: YANGJIE; Manufacturer Part: 1N4448WQ; Contributor: jordanjin; Convert to PCB: yes; UniqueId: gge179f786b32024c0a; ModelId: 5a61cd31046d4447ba73169a45a0935b; Origin Footprint: SOD-123_L2.7-W1.6-LS3.7-RD-1; Device: Диод импульсный 1N4448 [SOD-123]; Symbol: Диод импульсный 1N4448 [SOD-123]; Supplier: LCSC; JLCPCB Part Class: Extended Part; spicePre: V; spiceSymbolName: Диод импульсный 1N4448 [SOD-123]; Add into BOM: yes; FootprintName: SOD-123_L2.7-W1.6-LS3.7-RD-1; ModelName: SOD-123_L2.7-W1.6-LS3.7-RD-1
VD307 = Диод RS1M [SMA] (допускается замена на FR307 [DO-201AD]): Manufacturer: Wild Goose(威谷); Origin Footprint: SMA/DO-214AC; Contributor: lcsc; Convert to PCB: yes; UniqueId: gge794a92ba0b6788cd; Device: Диод RS1M [SMA] (допускается замена на FR307 [DO-201AD]); Symbol: Диод RS1M [SMA] (допускается замена на FR307 [DO-201AD]); Supplier: LCSC; Supplier Part: C22368778; Manufacturer Part: RS1M; JLCPCB Part Class: Extended Part; spicePre: D; spiceSymbolName: RS1M_C22368778; Add into BOM: yes
VD308 = Диод КД2970А [TO-220AC]: Manufacturer: NH(纽航); Manufacturer Part: MUR1560F; Contributor: lcsc; Convert to PCB: yes; UniqueId: gged3dbbafcc699cb47; Origin Footprint: TO-220AC-2_L10.0-W4.5-P5.08-T; Device: Диод КД2970А [TO-220AC]; Symbol: Диод КД2970А [TO-220AC]; Supplier: LCSC; Supplier Part: C7427763; JLCPCB Part Class: Extended Part; spicePre: D; spiceSymbolName: MUR1560F; Add into BOM: yes; FootprintName: TO-220AC-2_L10.0-W4.5-P5.08-T
VD309 = Диод RS1M [SMA] (допускается замена на FR307 [DO-201AD]): Manufacturer: Wild Goose(威谷); Origin Footprint: SMA/DO-214AC; Contributor: lcsc; Convert to PCB: yes; UniqueId: ggef16098dea476544d; Device: Диод RS1M [SMA] (допускается замена на FR307 [DO-201AD]); Symbol: Диод RS1M [SMA] (допускается замена на FR307 [DO-201AD]); Supplier: LCSC; Supplier Part: C22368778; Manufacturer Part: RS1M; JLCPCB Part Class: Extended Part; spicePre: D; spiceSymbolName: RS1M_C22368778; Add into BOM: yes
VD310 = Диод защитный 1.5KE56CA [DO-201AD/DO-27]: Manufacturer: Littelfuse(美国力特); Origin Footprint: DO-201_BD5.1-L8.4-P15.24-D1.0-BI; Contributor: LCSC; Convert to PCB: yes; UniqueId: ggee131634947b93899; ModelId: 0f2f91941ec54a41b2d5742b791fe179; Device: Диод защитный 1.5KE56CA [DO-201AD/DO-27]; Symbol: Диод защитный 1.5KE56CA [DO-201AD/DO-27]; Supplier: LCSC; Supplier Part: C1973354; Manufacturer Part: 1.5KE56CA; JLCPCB Part Class: Extended Part; spicePre: D; spiceSymbolName: 1.5KE56CA_C1973354; Add into BOM: yes; FootprintName: DO-201_BD5.1-L8.4-P15.24-D1.0-BI; ModelName: DO-201_BD5.1-L8.4-P15.24-D1.0-BI
VD311 = Диод RS1M [SMA] (допускается замена на FR307 [DO-201AD]): Manufacturer: Wild Goose(威谷); Origin Footprint: SMA/DO-214AC; Contributor: lcsc; Convert to PCB: yes; UniqueId: gge2daf95486076f531; Device: Диод RS1M [SMA] (допускается замена на FR307 [DO-201AD]); Symbol: Диод RS1M [SMA] (допускается замена на FR307 [DO-201AD]); Supplier: LCSC; Supplier Part: C22368778; Manufacturer Part: RS1M; JLCPCB Part Class: Extended Part; spicePre: D; spiceSymbolName: RS1M_C22368778; Add into BOM: yes
VD312 = Диод КД2970А [TO-220AC]: Manufacturer: NH(纽航); Manufacturer Part: MUR1560F; Contributor: lcsc; Convert to PCB: yes; UniqueId: gge4bf26c859eaa8598; Origin Footprint: TO-220AC-2_L10.0-W4.5-P5.08-T; Device: Диод КД2970А [TO-220AC]; Symbol: Диод КД2970А [TO-220AC]; Supplier: LCSC; Supplier Part: C7427763; JLCPCB Part Class: Extended Part; spicePre: D; spiceSymbolName: MUR1560F; Add into BOM: yes; FootprintName: TO-220AC-2_L10.0-W4.5-P5.08-T
VD313 = Диод RS1M [SMA] (допускается замена на FR307 [DO-201AD]): Manufacturer: Wild Goose(威谷); Origin Footprint: SMA/DO-214AC; Contributor: lcsc; Convert to PCB: yes; UniqueId: ggeaa0dfd477a3fa1b3; Device: Диод RS1M [SMA] (допускается замена на FR307 [DO-201AD]); Symbol: Диод RS1M [SMA] (допускается замена на FR307 [DO-201AD]); Supplier: LCSC; Supplier Part: C22368778; Manufacturer Part: RS1M; JLCPCB Part Class: Extended Part; spicePre: D; spiceSymbolName: RS1M_C22368778; Add into BOM: yes
VT301 = Транзистор DZTA92 PNP [SOT223]: Manufacturer: DIODES(美台); Manufacturer Part: DZTA92-13; Contributor: lcsc; Convert to PCB: yes; UniqueId: gge2a6b9c6c37b771ee; Origin Footprint: SOT-223-3_L6.5-W3.4-P2.30-LS7.0-BR; Device: Транзистор DZTA92 PNP [SOT223]; Symbol: Транзистор DZTA92 PNP [SOT223]; Supplier: LCSC; Supplier Part: C5205190; JLCPCB Part Class: Extended Part; spicePre: Q; spiceSymbolName: DZTA92-13; Add into BOM: yes; FootprintName: SOT-223-3_L6.5-W3.4-P2.30-LS7.0-BR
VT302 = Транзистор FZT758 PNP [SOT223]: Manufacturer: DIODES(美台); Manufacturer Part: FZT758TA; Contributor: LCSC; Convert to PCB: yes; UniqueId: gged3d453d57ec37b7c; Origin Footprint: SOT-223_L6.5-W3.5-P2.30-LS7.0-BR; Device: Транзистор FZT758 PNP [SOT223]; Symbol: Транзистор FZT758 PNP [SOT223]; Supplier: LCSC; Supplier Part: C99123; JLCPCB Part Class: Extended Part; spicePre: Q; spiceSymbolName: FZT758TA; Add into BOM: yes; FootprintName: SOT-223_L6.5-W3.5-P2.30-LS7.0-BR
VT303 = Транзистор DZTA42 NPN [SOT223]: Manufacturer: DIODES(美台); Manufacturer Part: DZTA42-13; Contributor: LCSC; Convert to PCB: yes; UniqueId: gge75cf3d941f093707; Origin Footprint: SOT-223-4_L6.5-W3.5-P2.30-LS7.0-BR; Device: Транзистор DZTA42 NPN [SOT223]; Symbol: Транзистор DZTA42 NPN [SOT223]; Supplier: LCSC; Supplier Part: C531150; JLCPCB Part Class: Extended Part; spicePre: Q; spiceSymbolName: DZTA42-13; Add into BOM: yes; FootprintName: SOT-223-4_L6.5-W3.5-P2.30-LS7.0-BR
VT304 = Транзистор FZT658 NPN [SOT223]: Manufacturer: DIODES(美台); Contributor: lcsc; Convert to PCB: yes; UniqueId: gge36d44b89134af167; Origin Footprint: SOT-223_L6.5-W3.5-P2.30-LS7.0-BR; Device: Транзистор FZT658 NPN [SOT223]; Symbol: Транзистор FZT658 NPN [SOT223]; Supplier: LCSC; Supplier Part: C5245513; Manufacturer Part: FZT658; JLCPCB Part Class: Extended Part; spicePre: Q; spiceSymbolName: FZT658; Add into BOM: yes; FootprintName: SOT-223_L6.5-W3.5-P2.30-LS7.0-BR
VT305 = Транзистор DZTA42 NPN [SOT223]: Manufacturer: DIODES(美台); Manufacturer Part: DZTA42-13; Contributor: LCSC; Convert to PCB: yes; UniqueId: gge2c6f7b2339f7cfb0; Origin Footprint: SOT-223-4_L6.5-W3.5-P2.30-LS7.0-BR; Device: Транзистор DZTA42 NPN [SOT223]; Symbol: Транзистор DZTA42 NPN [SOT223]; Supplier: LCSC; Supplier Part: C531150; JLCPCB Part Class: Extended Part; spicePre: Q; spiceSymbolName: DZTA42-13; Add into BOM: yes; FootprintName: SOT-223-4_L6.5-W3.5-P2.30-LS7.0-BR
VT306 = Транзистор DZTA92 PNP [SOT223]: Manufacturer: DIODES(美台); Manufacturer Part: DZTA92-13; Contributor: lcsc; Convert to PCB: yes; UniqueId: gge53a830cd39e0fe90; Origin Footprint: SOT-223-3_L6.5-W3.4-P2.30-LS7.0-BR; Device: Транзистор DZTA92 PNP [SOT223]; Symbol: Транзистор DZTA92 PNP [SOT223]; Supplier: LCSC; Supplier Part: C5205190; JLCPCB Part Class: Extended Part; spicePre: Q; spiceSymbolName: DZTA92-13; Add into BOM: yes; FootprintName: SOT-223-3_L6.5-W3.4-P2.30-LS7.0-BR
VT307 = Транзистор DZTA42 NPN [SOT223]: Manufacturer: DIODES(美台); Manufacturer Part: DZTA42-13; Contributor: LCSC; Convert to PCB: yes; UniqueId: gge6f2a1d437dc2c420; Origin Footprint: SOT-223-4_L6.5-W3.5-P2.30-LS7.0-BR; Device: Транзистор DZTA42 NPN [SOT223]; Symbol: Транзистор DZTA42 NPN [SOT223]; Supplier: LCSC; Supplier Part: C531150; JLCPCB Part Class: Extended Part; spicePre: Q; spiceSymbolName: DZTA42-13; Add into BOM: yes; FootprintName: SOT-223-4_L6.5-W3.5-P2.30-LS7.0-BR
VT308 = Транзистор DZTA92 PNP [SOT223]: Manufacturer: DIODES(美台); Manufacturer Part: DZTA92-13; Contributor: lcsc; Convert to PCB: yes; UniqueId: gge963799024921d3de; Origin Footprint: SOT-223-3_L6.5-W3.4-P2.30-LS7.0-BR; Device: Транзистор DZTA92 PNP [SOT223]; Symbol: Транзистор DZTA92 PNP [SOT223]; Supplier: LCSC; Supplier Part: C5205190; JLCPCB Part Class: Extended Part; spicePre: Q; spiceSymbolName: DZTA92-13; Add into BOM: yes; FootprintName: SOT-223-3_L6.5-W3.4-P2.30-LS7.0-BR
VT309 = Транзистор ZXMN10A08E6 N-канал 100В 1.9А [SOT-23-6]: Manufacturer: VBsemi(微碧半导体); Manufacturer Part: ZXMN10A08E6TA-VB; Contributor: lcsc; Convert to PCB: yes; UniqueId: gge24745a0efea1fab5; ModelId: fbaa6bae3316461e97873e024a06a308; Origin Footprint: SOT-23-6_L2.9-W1.6-P0.95-LS2.7-BL; Device: Транзистор ZXMN10A08E6 N-канал 100В 1.9А [SOT-23-6]; Symbol: Транзистор ZXMN10A08E6 N-канал 100В 1.9А [SOT-23-6]; Supplier: LCSC; Supplier Part: C19190217; JLCPCB Part Class: Extended Part; spicePre: Q; spiceSymbolName: ZXMN10A08E6TA-VB; Add into BOM: yes; FootprintName: SOT-23-6_L2.9-W1.6-P0.95-LS2.7-BL; ModelName: SOT-23-6_L2.9-W1.6-P0.95-LS2.7-BL
VT310 = Транзистор ZXMP10A17E6 P-канал 100В 1.3А [SOT-23-6]: Manufacturer: DIODES(美台); Manufacturer Part: ZXMP10A17E6QTA; Contributor: lcsc; Convert to PCB: yes; UniqueId: ggea1c2360fcbdc7461; Origin Footprint: SOT-23-6_L2.9-W1.6-P0.95-LS2.8-BL; Device: Транзистор ZXMP10A17E6 P-канал 100В 1.3А [SOT-23-6]; Symbol: Транзистор ZXMP10A17E6 P-канал 100В 1.3А [SOT-23-6]; Supplier: LCSC; Supplier Part: C6044635; JLCPCB Part Class: Extended Part; spicePre: Q; spiceSymbolName: ZXMP10A17E6QTA; Add into BOM: yes; FootprintName: SOT-23-6_L2.9-W1.6-P0.95-LS2.8-BL
VT311 = Транзистор DZTA92 PNP [SOT223]: Manufacturer: DIODES(美台); Manufacturer Part: DZTA92-13; Contributor: lcsc; Convert to PCB: yes; UniqueId: ggeab0a8fe0e3572336; Origin Footprint: SOT-223-3_L6.5-W3.4-P2.30-LS7.0-BR; Device: Транзистор DZTA92 PNP [SOT223]; Symbol: Транзистор DZTA92 PNP [SOT223]; Supplier: LCSC; Supplier Part: C5205190; JLCPCB Part Class: Extended Part; spicePre: Q; spiceSymbolName: DZTA92-13; Add into BOM: yes; FootprintName: SOT-223-3_L6.5-W3.4-P2.30-LS7.0-BR
VT312 = Транзистор FQP13N10  N-канал 100В 12.8А [TO-220]: Manufacturer: onsemi(安森美); Origin Footprint: TO-220-3; Contributor: lcsc; Convert to PCB: yes; UniqueId: gge4010ba0ce69534a7; Device: Транзистор FQP13N10  N-канал 100В 12.8А [TO-220]; Symbol: Транзистор FQP13N10  N-канал 100В 12.8А [TO-220]; Supplier: LCSC; Supplier Part: C243077; Manufacturer Part: FQP13N10; JLCPCB Part Class: Extended Part; spicePre: Q; spiceSymbolName: FQP13N10; Add into BOM: yes
VT313 = Транзистор SFP9530 P-канал 100В 10.5А [TO-220]: Manufacturer: onsemi; Origin Footprint: TO-220-3; Contributor: jordanjin; Convert to PCB: yes; UniqueId: ggecaf0417d2865ea34; Device: Транзистор SFP9530 P-канал 100В 10.5А [TO-220]; Symbol: Транзистор SFP9530 P-канал 100В 10.5А [TO-220]; Supplier: LCSC; Manufacturer Part: SFP9530; JLCPCB Part Class: Extended Part; spicePre: V; spiceSymbolName: Транзистор SFP9530 P-канал 100В 10.5А [TO-220]; Add into BOM: yes
VT314 = Транзистор DZTA42 NPN [SOT223]: Manufacturer: DIODES(美台); Manufacturer Part: DZTA42-13; Contributor: LCSC; Convert to PCB: yes; UniqueId: ggea7a9202f086c4e5b; Origin Footprint: SOT-223-4_L6.5-W3.5-P2.30-LS7.0-BR; Device: Транзистор DZTA42 NPN [SOT223]; Symbol: Транзистор DZTA42 NPN [SOT223]; Supplier: LCSC; Supplier Part: C531150; JLCPCB Part Class: Extended Part; spicePre: Q; spiceSymbolName: DZTA42-13; Add into BOM: yes; FootprintName: SOT-223-4_L6.5-W3.5-P2.30-LS7.0-BR
VT315 = Транзистор MJE5730G PNP [TO-220-3]: Manufacturer: onsemi(安森美); Contributor: LCSC; Convert to PCB: yes; UniqueId: gge5eed697d29ebfe8b; ModelId: 37b5e9fc6b50491dae7b150eb9821ae3; Origin Footprint: TO-220-3_L10.0-W4.5-P2.54-L; Device: Транзистор MJE5730G PNP [TO-220-3]; Symbol: Транзистор MJE5730G PNP [TO-220-3]; Supplier: LCSC; Supplier Part: C897091; Manufacturer Part: MJE5730G; JLCPCB Part Class: Extended Part; spicePre: Q; spiceSymbolName: MJE5730G; Add into BOM: yes; FootprintName: TO-220-3_L10.0-W4.5-P2.54-L; ModelName: TO-220-3_L10.0-W4.5-P2.54-L
VT316 = Транзистор TIP48 NPN [TO-220-3]: Manufacturer: onsemi(安森美); Manufacturer Part: TIP48G; Contributor: lcsc; Convert to PCB: yes; UniqueId: gge2b3603b9172bdb05; ModelId: 37b5e9fc6b50491dae7b150eb9821ae3; Origin Footprint: TO-220-3_L10.0-W4.5-P2.54-L; Device: Транзистор TIP48 NPN [TO-220-3]; Symbol: Транзистор TIP48 NPN [TO-220-3]; Supplier: LCSC; Supplier Part: C233726; JLCPCB Part Class: Extended Part; spicePre: Q; spiceSymbolName: TIP48G; Add into BOM: yes; FootprintName: TO-220-3_L10.0-W4.5-P2.54-L; ModelName: TO-220-3_L10.0-W4.5-P2.54-L